# Altium schematic sheet stm32pcb.SchDoc
size A4; SheetNumber: 1; SheetTotal: 1
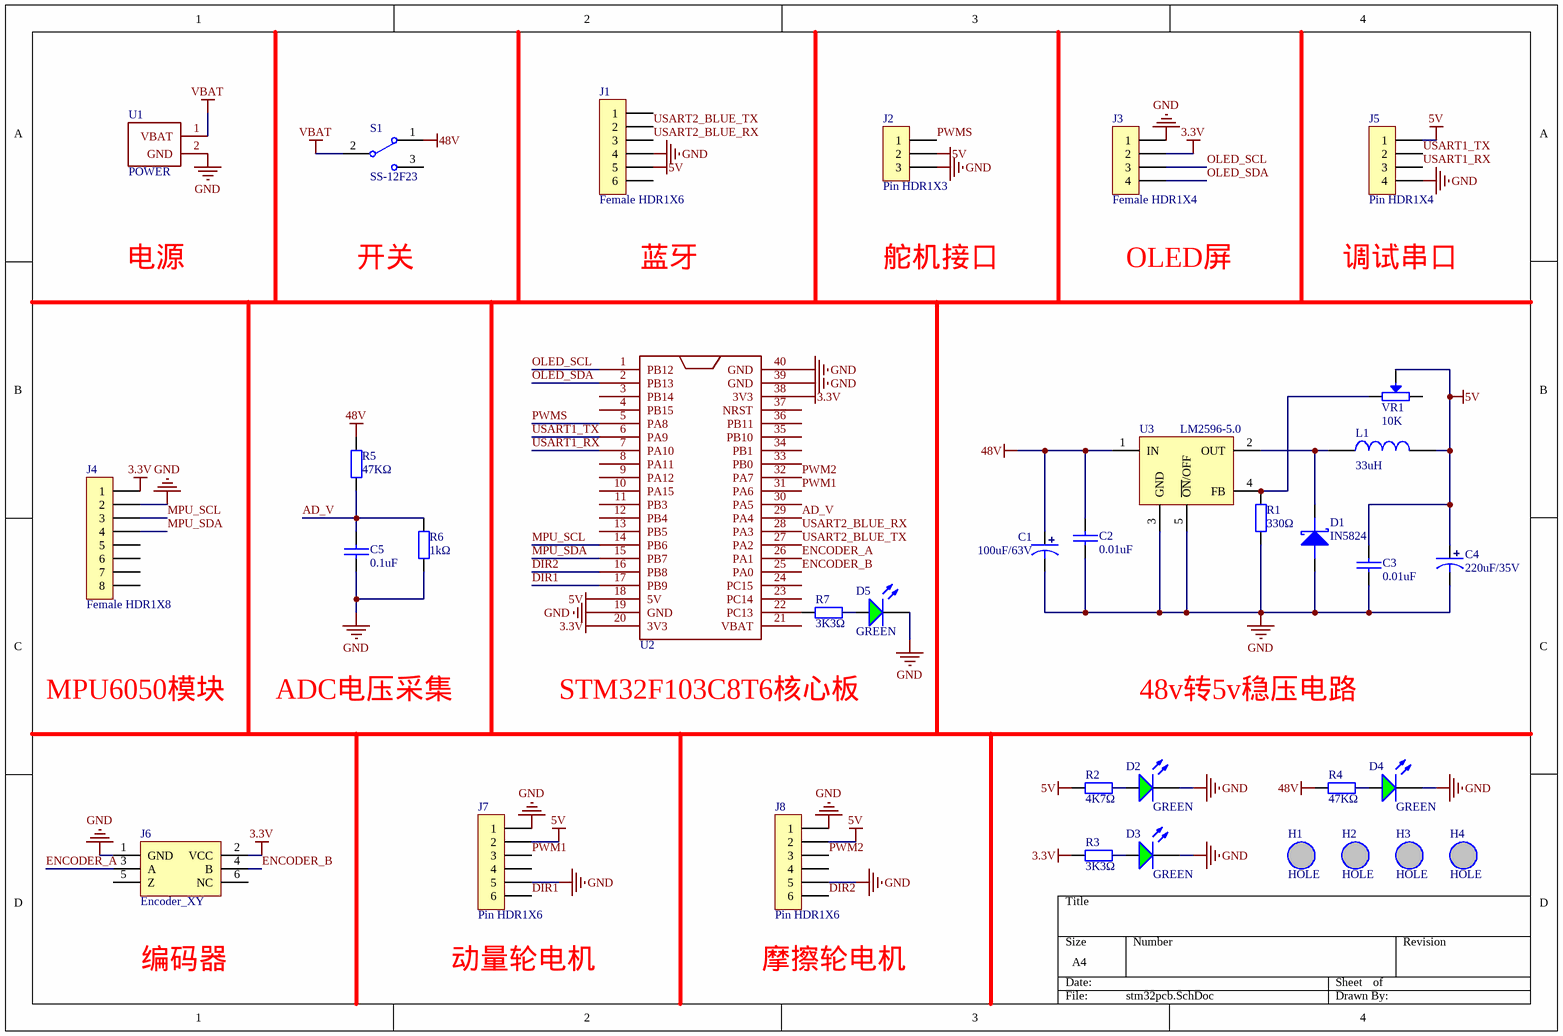
[diagram p0: stm32pcb.SchDoc]

## Parts
C1  100uF/63V  [SMD-EC8X8X10]
C2  0.01uF  [0603C]
C3  0.01uF  [0603C]
C4  220uF/35V  [SMD-EC8X8X10]
C5  0.1uF  [0603C]
D1  IN5824  [SMA/DO-214AC]
D2  GREEN  [0805_LED_S1]
D3  GREEN  [0805_LED_S1]
D4  GREEN  [0805_LED_S1]
D5  GREEN  [0805_LED_S1]
H1  HOLE  [LQ_SCROW3&5MM]
H2  HOLE  [LQ_SCROW3&5MM]
H3  HOLE  [LQ_SCROW3&5MM]
H4  HOLE  [LQ_SCROW3&5MM]
J1  Female HDR1X6  [Fe-HDR1X6/2.54-S]
J2  Pin HDR1X3  [Pin HDR1X3/2.54mm-W]
J3  Female HDR1X4  [Fe-HDR1X4/2.54-S]
J4  Female HDR1X8  [Fe-HDR1X8/2.54-S]
J5  Pin HDR1X4  [Pin HDR1X4/2.54mm-W]
J6  Encoder_XY  [Pin HDR2X3/2.54mm-S]
J7  Pin HDR1X6  [Pin HDR1X6/2.54mm-W]
J8  Pin HDR1X6  [Pin HDR1X6/2.54mm-W]
L1  33uH  [CD75]
R1  330Ω  [0603_R]
R2  4K7Ω  [0603_R]
R3  3K3Ω  [0603_R]
R4  47KΩ  [0603_R]
R5  47KΩ  [0603_R]
R6  1kΩ  [0603_R]
R7  3K3Ω  [0603_R]
S1  SS-12F23  [SS-12F23]
U1  POWER  [KF301-5.0-2P]
U2  STM32F103C8T6 MODULE  [STM32F103C8T6 MODULE]  (value not drawn)
U3  LM2596-5.0  [TO263-5A]
VR1  10K  [3296W]

## Nets
3.3V: J3.2 J4.1 J6.2(VCC) R3.1 U2.20(3V3) U2.38(3V3)
5V: C3.2 C4.1 J1.5 J2.2 J5.1 J7.2 J8.2 L1.2 R2.1 U2.18(5V) VR1.2
48V: C1.1 C2.2 R4.1 R5.1 S1.1 U3.1(IN)
GND: C1.2 C2.1 C3.1 C4.2 C5.1 D1.A D2.K D3.K D4.K D5.K J1.4 J2.3 J3.1 J4.2 J5.4 J6.1(GND) J7.1 J7.5 J8.1 J8.5 R1.2 R6.2 U1.2(GND) U2.19(GND) U2.39(GND) U2.40(GND) U3.3(GND) U3.5(~{ON}/OFF)
VBAT: S1.2 U1.1(VBAT)
AD_V: C5.2 R5.2 R6.1 U2.29(PA4)
DIR1: J7.6 U2.17(PB9)
DIR2: J8.6 U2.16(PB8)
ENCODER_A: J6.3(A) U2.26(PA1)
ENCODER_B: J6.4(B) U2.25(PA0)
MPU_SCL: J4.3 U2.14(PB6)
MPU_SDA: J4.4 U2.15(PB7)
OLED_SCL: J3.3 U2.1(PB12)
OLED_SDA: J3.4 U2.2(PB13)
PWM1: J7.3 U2.31(PA6)
PWM2: J8.3 U2.32(PA7)
PWMS: J2.1 U2.5(PA8)
USART1_RX: J5.3 U2.7(PA10)
USART1_TX: J5.2 U2.6(PA9)
USART2_BLUE_RX: J1.3 U2.28(PA3)
USART2_BLUE_TX: J1.2 U2.27(PA2)
NetD1_K: D1.K L1.1 U3.2(OUT)
NetD2_A: D2.A R2.2
NetD3_A: D3.A R3.2
NetD4_A: D4.A R4.2
NetD5_A: D5.A R7.2
NetR1_1: R1.1 U3.4(FB) VR1.1
NetR7_1: R7.1 U2.22(PC13)

Not connected (* = marked no-connect by the designer): J1 1 6; J4 5 6 7 8; J6 5(Z) 6(NC); J7 4; J8 4; S1 3; U2 3(PB14) 4(PB15) 8(PA11) 9(PA12) 10(PA15) 11(PB3) 12(PB4) 13(PB5) 21(VBAT) 23(PC14) 24(PC15) 30(PA5) 33(PB0) 34(PB1) 35(PB10) 36(PB11) 37(NRST)

## Notes on the sheet
- 电源
- 开关
- 蓝牙
- 舵机接口
- OLED屏
- 调试串口
- MPU6050模块
- ADC电压采集
- STM32F103C8T6核心板
- 48v转5v稳压电路
- 编码器
- (near J7) 动量轮电机
- (near J8) 摩擦轮电机

## Library data of the parts
C1 C4 = SMD_ECAP: 贴片电解电容
C2 C3 C5 = CAP_1: 无极性电容
D1 = DIODE SCHOTTKY: 肖特基二极管
D2-D5 = 0805 翠绿: 发光二极管; ComponentLink1Description: 供应商链接; ComponentLink1URL: http://www.szlcsc.com/product/details_2670.html; Package: 0805; Supplier: LC; SuppliersPartNumber: C2297
H1-H4 = HOLE: 固定孔
J6 = Encoder_XY: 正交编码器
L1 = INDUCTOR
R1-R7 = 0603 330Ω (3300) 1%: 贴片电阻; ComponentLink1Description: 供应商链接; ComponentLink1URL: http://www.szlcsc.com/product/details_23865.html; Package: 0603; Supplier: LC; SuppliersPartNumber: C23138
U1 = 电源焊点
U3 = LM2596-5.0: DC降压芯片
VR1 = RESVR